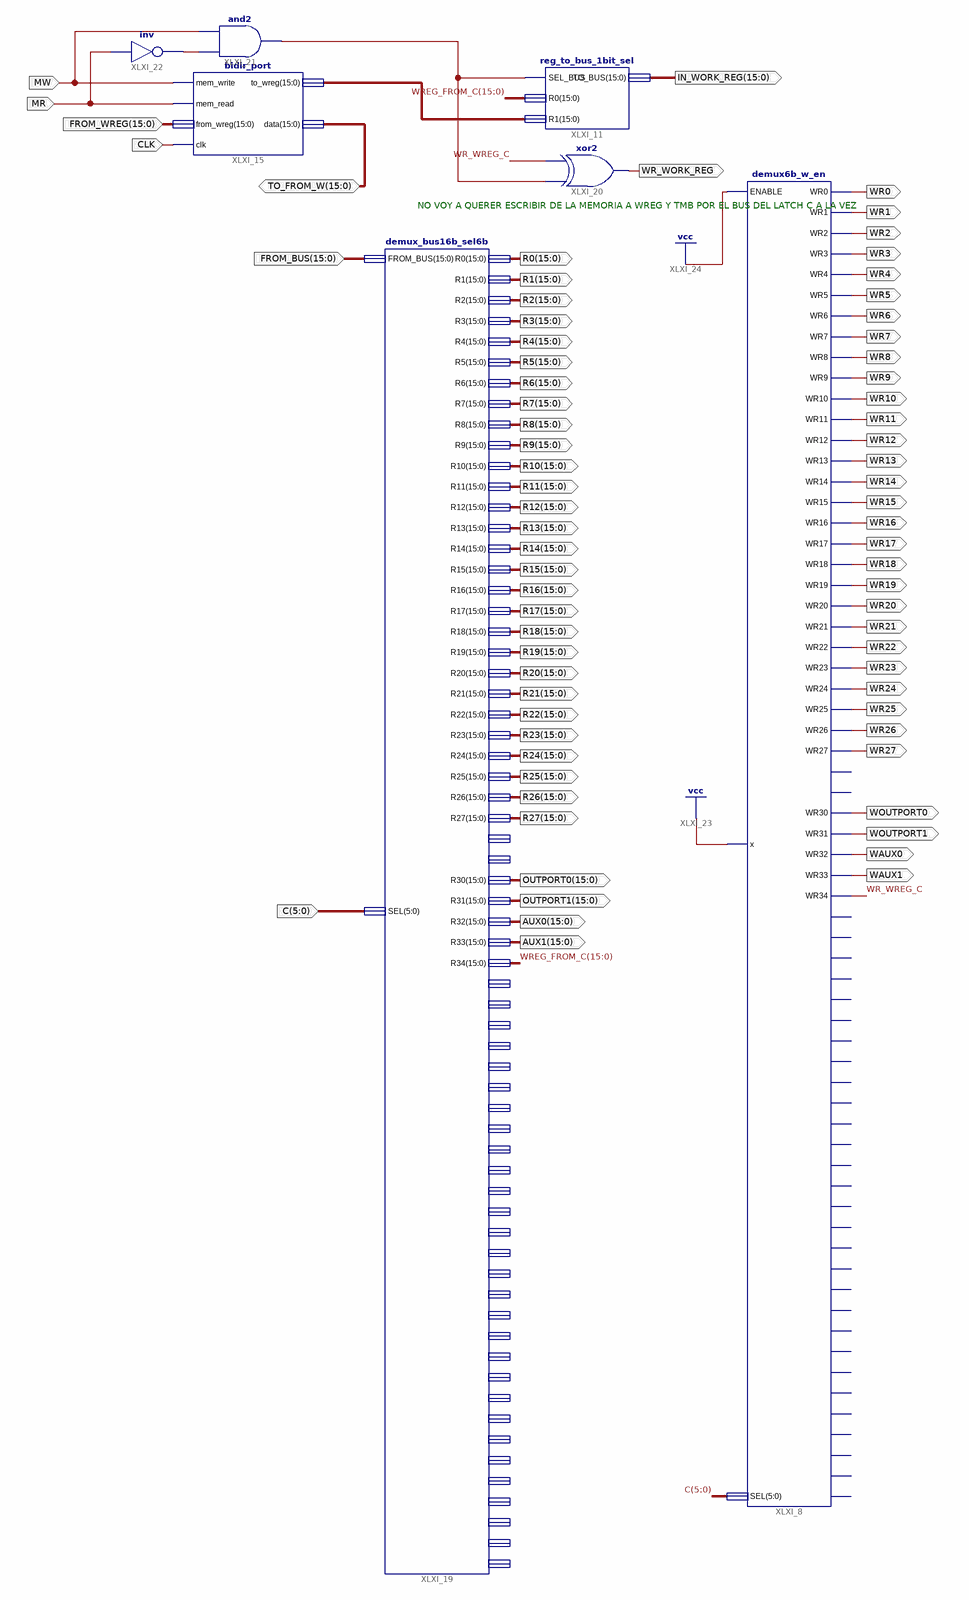
[diagram p0: schematic sheet 1]
// Xilinx ISE schematic bloque2.sch (artix7) as structural Verilog: 7 symbols, 73 ports
module bloque2 (
  input  [15:0] FROM_BUS,
  input  [5:0] C,
  input  MR,
  input  [15:0] FROM_WREG,
  input  CLK,
  input  MW,
  inout  [15:0] TO_FROM_W,
  output [15:0] R1,
  output [15:0] R2,
  output [15:0] R3,
  output [15:0] R4,
  output [15:0] R5,
  output [15:0] R6,
  output [15:0] R7,
  output [15:0] R8,
  output [15:0] R9,
  output [15:0] R10,
  output [15:0] R11,
  output [15:0] R12,
  output [15:0] R13,
  output [15:0] R14,
  output [15:0] R15,
  output [15:0] R16,
  output [15:0] R17,
  output [15:0] R18,
  output [15:0] R19,
  output [15:0] R20,
  output [15:0] R21,
  output [15:0] R22,
  output [15:0] R23,
  output [15:0] R24,
  output [15:0] R25,
  output [15:0] R26,
  output [15:0] R27,
  output WR0,
  output WR1,
  output WR2,
  output WR3,
  output WR4,
  output WR5,
  output WR6,
  output WR7,
  output WR8,
  output WR9,
  output WR10,
  output WR11,
  output WR12,
  output WR13,
  output WR14,
  output WR15,
  output WR16,
  output WR17,
  output WR18,
  output WR19,
  output WR20,
  output WR21,
  output WR22,
  output WR23,
  output WR24,
  output WR25,
  output WR26,
  output WR27,
  output [15:0] OUTPORT0,
  output [15:0] OUTPORT1,
  output [15:0] AUX0,
  output [15:0] AUX1,
  output WOUTPORT0,
  output WOUTPORT1,
  output WAUX0,
  output WAUX1,
  output [15:0] IN_WORK_REG,
  output WR_WORK_REG,
  output [15:0] R0
);

  wire WR_WREG_C, XLXN_3, XLXN_6;
  wire [15:0] to_wreg, WREG_FROM_C;

  demux6b_w_en XLXI_8 (
    .ENABLE(1'b1), .x(1'b1), .SEL(C), .WR0(WR0), .WR1(WR1), .WR2(WR2), .WR3(WR3), .WR4(WR4), .WR5(WR5),
    .WR6(WR6), .WR7(WR7), .WR8(WR8), .WR9(WR9), .WR10(WR10), .WR11(WR11), .WR12(WR12), .WR13(WR13),
    .WR14(WR14), .WR15(WR15), .WR16(WR16), .WR17(WR17), .WR18(WR18), .WR19(WR19), .WR20(WR20), .WR21(WR21),
    .WR22(WR22), .WR23(WR23), .WR24(WR24), .WR25(WR25), .WR26(WR26), .WR27(WR27), .WR30(WOUTPORT0),
    .WR31(WOUTPORT1), .WR32(WAUX0), .WR33(WAUX1), .WR34(WR_WREG_C));  // open: WR28, WR29, WR35, WR36, WR37, WR38, WR39, WR40, WR41, WR42, WR43, WR44, WR45, WR46, WR47, WR48, WR49, WR50, WR51, WR52, WR53, WR54, WR55, WR56, WR57, WR58, WR59, WR60, WR61, WR62, WR63
  reg_to_bus_1bit_sel XLXI_11 (.SEL_BUS(XLXN_6), .R0(WREG_FROM_C), .R1(to_wreg), .TO_BUS(IN_WORK_REG));
  bidir_port XLXI_15 (
    .mem_write(MW), .mem_read(MR), .from_wreg(FROM_WREG), .data(TO_FROM_W), .to_wreg(to_wreg), .clk(CLK));
  demux_bus16b_sel6b XLXI_19 (
    .FROM_BUS(FROM_BUS), .SEL(C), .R0(R0), .R1(R1), .R2(R2), .R3(R3), .R4(R4), .R5(R5), .R6(R6), .R7(R7),
    .R8(R8), .R9(R9), .R10(R10), .R11(R11), .R12(R12), .R13(R13), .R14(R14), .R15(R15), .R16(R16), .R17(R17),
    .R18(R18), .R19(R19), .R20(R20), .R21(R21), .R22(R22), .R23(R23), .R24(R24), .R25(R25), .R26(R26),
    .R27(R27), .R30(OUTPORT0), .R31(OUTPORT1), .R32(AUX0), .R33(AUX1), .R34(WREG_FROM_C));  // open: R28, R29, R35, R36, R37, R38, R39, R40, R41, R42, R43, R44, R45, R46, R47, R48, R49, R50, R51, R52, R53, R54, R55, R56, R57, R58, R59, R60, R61, R62, R63
  xor XLXI_20 (WR_WORK_REG, XLXN_6, WR_WREG_C);
  and XLXI_21 (XLXN_6, XLXN_3, MW);
  not XLXI_22 (XLXN_3, MR);

  // Notes on the sheet:
  //   NO VOY A QUERER ESCRIBIR DE LA MEMORIA A WREG Y TMB POR EL BUS DEL LATCH C A LA VEZ
endmodule
